# Altium schematic sheet RF.SchDoc
size A4
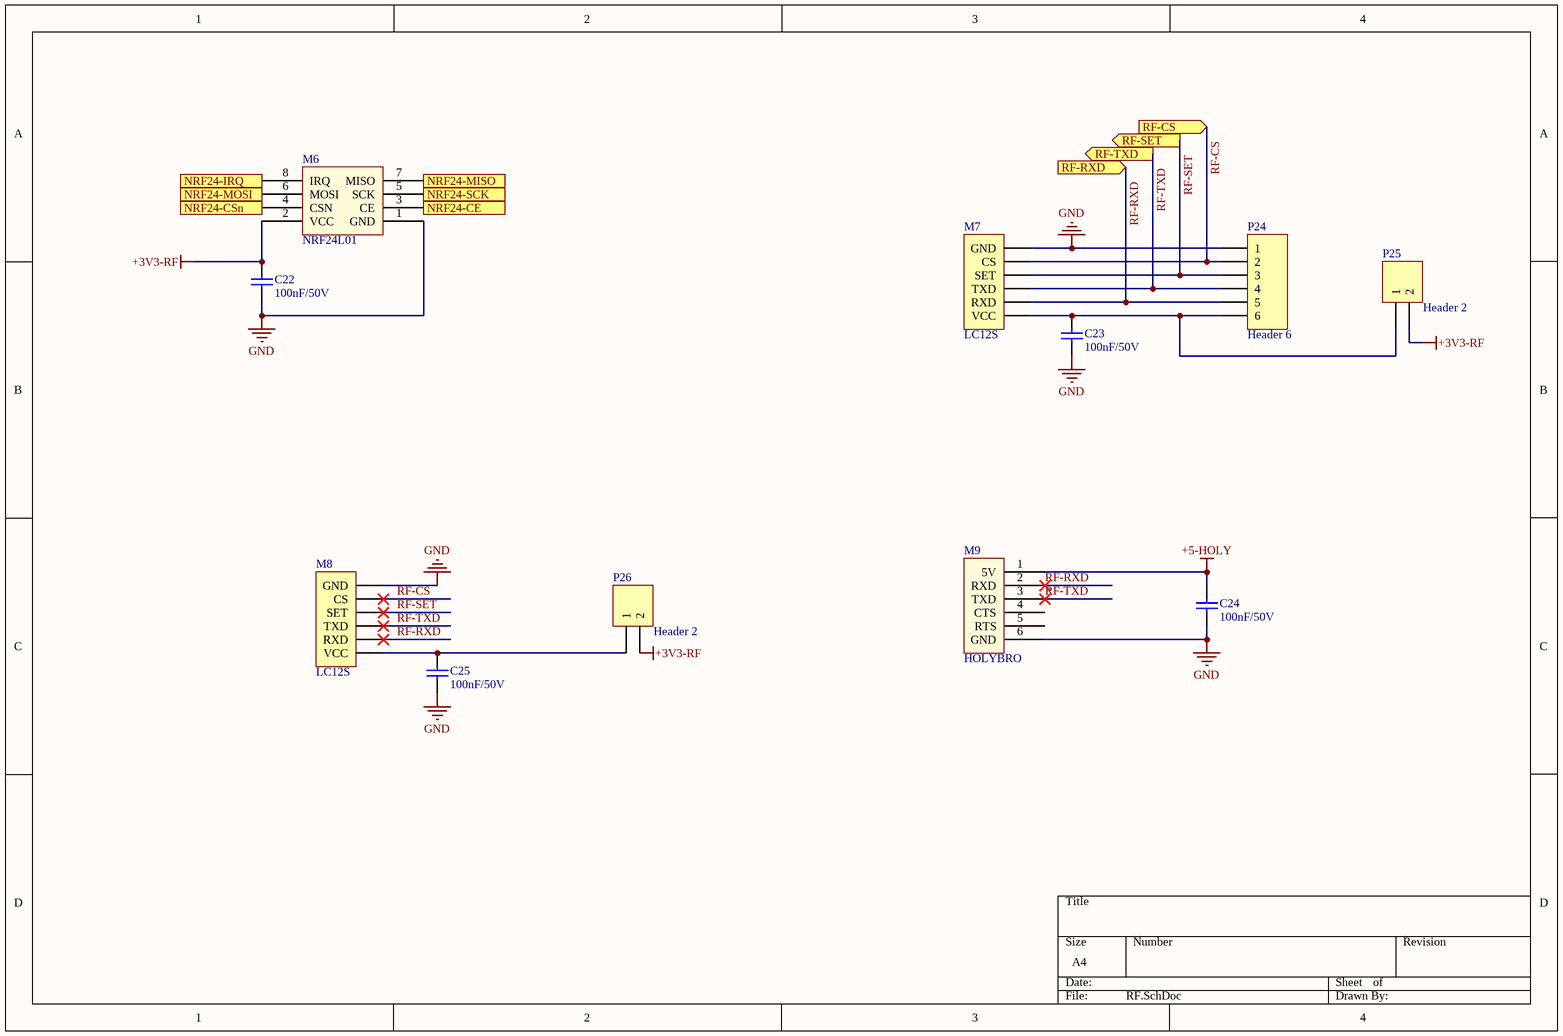
[diagram p0: RF.SchDoc]

## Parts
C22  value 100nF/50V  [CAP-SM-0805]  (hidden comment: Cap-100nF-50V-0805)
C23  value 100nF/50V  [CAP-SM-0805]  (hidden comment: Cap-100nF-50V-0805)
C24  value 100nF/50V  [CAP-SM-0805]  (hidden comment: Cap-100nF-50V-0805)
C25  value 100nF/50V  [CAP-SM-0805]  (hidden comment: Cap-100nF-50V-0805)
M6  NRF24L01
M7  LC12S
M8  LC12S
M9  HOLYBRO
P24  Header 6  [HDR1X6]
P25  Header 2  [HDR1X2]
P26  Header 2  [HDR1X2]

## Ports
NRF24-CE (in), NRF24-CSn (in), NRF24-IRQ (out), NRF24-MISO (out), NRF24-MOSI (in), NRF24-SCK (in), RF-CS (in), RF-RXD (in), RF-SET (out), RF-TXD (out)

## Nets
+3V3-RF: C22.2 M6.2(VCC) P25.2 P26.2
+5-HOLY: C24.2 M9.1(5V)
GND: C22.1 C23.1 C24.1 C25.1 M6.1(GND) M7.6(GND) M8.6(GND) M9.6(GND) P24.1
NRF24-CE: M6.3(CE) ; port NRF24-CE
NRF24-CSn: M6.4(CSN) ; port NRF24-CSn
NRF24-IRQ: M6.8(IRQ) ; port NRF24-IRQ
NRF24-MISO: M6.7(MISO) ; port NRF24-MISO
NRF24-MOSI: M6.6(MOSI) ; port NRF24-MOSI
NRF24-SCK: M6.5(SCK) ; port NRF24-SCK
RF-CS: M7.5(CS) M8.5(CS) P24.2 ; port RF-CS
RF-RXD: M7.2(RXD) M8.2(RXD) M9.2(RXD) P24.5 ; port RF-RXD
RF-SET: M7.4(SET) M8.4(SET) P24.3 ; port RF-SET
RF-TXD: M7.3(TXD) M8.3(TXD) M9.3(TXD) P24.4 ; port RF-TXD
NetC23_2: C23.2 M7.1(VCC) P24.6 P25.1
NetC25_2: C25.2 M8.1(VCC) P26.1

Not connected (* = marked no-connect by the designer): M9 4(CTS) 5(RTS)

## Library data of the parts
C22-C25 = Cap-100nF-50V-0805: CAP CER 0.1UF 50V Y5V 0805; Manufacturer: Samsung Electro-Mechanics; Manufacturer Part Number: CL21F104ZBCNNNC; Local Supplier: thegioiic; Local Supplier Link: https://thegioiic.com/products/tu-100nf-0-1uf-50v-0805; Supplier 1: Digikey; Supplier 1 Part Number: 1276-1007-1-ND; Supplier 1 Link: https://www.digikey.com/product-detail/en/samsung-electro-mechanics/CL21F104ZBCNNNC/1276-1007-1-ND/3889093
P24 = Header 6: Header, 6-Pin; LatestRevisionDate: 17-Jul-2002; LatestRevisionNote: Re-released for DXP Platform.; Publisher: Altium Limited
P25 P26 = Header 2: Header, 2-Pin; LatestRevisionDate: 17-Jul-2002; LatestRevisionNote: Re-released for DXP Platform.; Publisher: Altium Limited